# Altium schematic sheet CAN_Audio.SchDoc: CAN & Audio
size A4; Organization: Use Organization_Name in ProjParam; Address1: EFI & DBR; Address2: STI-IMT-LSRO1; Address3: EPFL; Address4: CH-1015 LAUSANNE; DocumentNumber: 4; Revision: A; SheetNumber: 4; SheetTotal: 2; ApprovedBy: Init ApprovedBy in DocParam; CheckedBy: Init CheckedBy in DocParam; Author: Init Author in DocParam; CompanyName: Init CompanyName in DocParam; DrawnBy: Init DrawBy in DocParam; Engineer: Init Engineer in DocParam; DocumentName: Init DocumentName in DocParam; ProjectName: Init ProjectName in DocParam
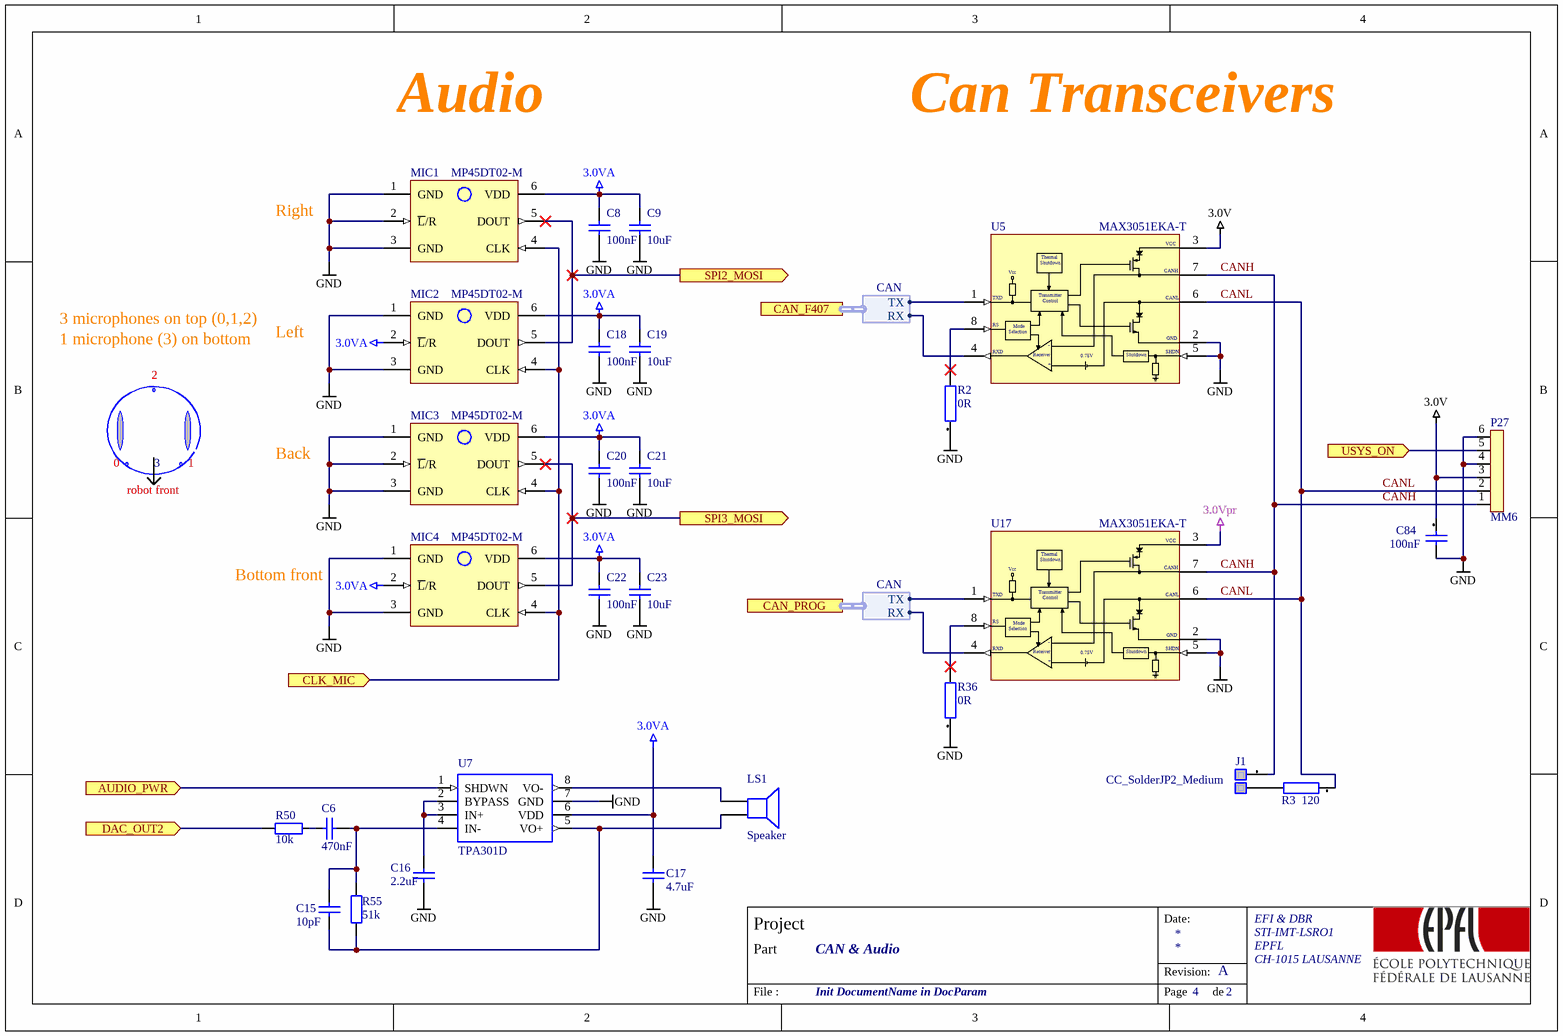
[diagram p0: CAN_Audio.SchDoc]

## Parts
C6  470nF  [ROB_0603]
C8  100nF  [ROB_0603]
C9  10uF  [ROB_0603]
C15  10pF  [ROB_0603]
C16  2.2uF  [ROB_0603]
C17  4.7uF  [rob_0603]
C18  100nF  [ROB_0603]
C19  10uF  [ROB_0603]
C20  100nF  [ROB_0603]
C21  10uF  [ROB_0603]
C22  100nF  [ROB_0603]
C23  10uF  [ROB_0603]
C84  100nF  [ROB_0603]
J1  CC_SolderJP2_Medium  [soldeJP_M]  (no BOM)
LS1  Speaker  [DS-1389]
MIC1  MP45DT02-M  [HLGA-6L]
MIC2  MP45DT02-M  [HLGA-6L]
MIC3  MP45DT02-M  [HLGA-6L]
MIC4  MP45DT02-M  [HLGA-6L]
P27  MM6  [TYCO_7-188275-6]
R2  0R  [ROB_0603]
R3  120  [ROB_0603]
R36  0R  [ROB_0603]
R50  10k  [ROB_0603]
R55  51k  [ROB_0603]
U5  MAX3051EKA-T  [SOT23-8]
U7  TPA301D  [SO-8]
U17  MAX3051EKA-T  [SOT23-8]

## Ports
AUDIO_PWR (in), CAN_F407 (harness CAN), CAN_PROG (harness CAN), CLK_MIC (in), DAC_OUT2 (in), SPI2_MOSI (out), SPI3_MOSI (out), USYS_ON (in)

## Harnesses
CAN: TX, RX

## Nets
3.0V: C84.1 P27.3 U5.3(VCC)
3.0VA: C8.2 C9.2 C17.2 C18.2 C19.2 C20.2 C21.2 C22.2 C23.2 MIC1.6(VDD) MIC2.2(~{L}/R) MIC2.6(VDD) MIC3.6(VDD) MIC4.2(~{L}/R) MIC4.6(VDD) U7.6(VDD)
3.0Vpr: U17.3(VCC)
GND: C8.1 C9.1 C16.2 C17.1 C18.1 C19.1 C20.1 C21.1 C22.1 C23.1 C84.2 MIC1.1(GND) MIC1.2(~{L}/R) MIC1.3(GND) MIC2.1(GND) MIC2.3(GND) MIC3.1(GND) MIC3.2(~{L}/R) MIC3.3(GND) MIC4.1(GND) MIC4.3(GND) P27.4 P27.6 R2.1 R36.1 U5.2(GND) U5.5(SHDN) U7.7(GND) U17.2(GND) U17.5(SHDN)
AUDIO_PWR: U7.1(SHDWN) ; port AUDIO_PWR
CANH: J1.1 P27.1 U5.7(CANH) U17.7(CANH)
CANL: P27.2 R3.1 U5.6(CANL) U17.6(CANL)
CLK_MIC: MIC1.4(CLK) MIC2.4(CLK) MIC3.4(CLK) MIC4.4(CLK) ; port CLK_MIC
DAC_OUT2: R50.1 ; port DAC_OUT2
SPI2_MOSI: MIC1.5(DOUT) MIC2.5(DOUT) ; port SPI2_MOSI
SPI3_MOSI: MIC3.5(DOUT) MIC4.5(DOUT) ; port SPI3_MOSI
USYS_ON: P27.5 ; port USYS_ON
NetC6_1: C6.1 C15.2 R55.1 U7.4(IN-)
NetC6_2: C6.2 R50.2
NetC15_1: C15.1 LS1.1 R55.2 U7.5(VO+)
NetC16_1: C16.1 U7.2(BYPASS) U7.3(IN+)
NetJ1_2: J1.2 R3.2
NetLS1_2: LS1.2 U7.8(VO-)
NetR2_2: R2.2 U5.8(RS)
NetR36_2: R36.2 U17.8(RS)
NetU5_1: U5.1(TXD) ; port CAN_F407.TX
NetU5_4: U5.4(RXD) ; port CAN_F407.RX
NetU17_1: U17.1(TXD) ; port CAN_PROG.TX
NetU17_4: U17.4(RXD) ; port CAN_PROG.RX

## Notes on the sheet
- Audio
- Can Transceivers
- Right
- 3 microphones on top (0,1,2)
- 1 microphone (3) on bottom
- 2
- Left
- 0
- robot front
- 3
- 1
- Back
- Bottom front
- Date:
- Project
- Part
- Revision:
- File :
- Page
- de
- (in symbol MAX3051EKA-T[[/\]]1) Thermal; Shutdown; Vcc; Transmitter; Control; Mode; Selection; -; Receiver; 0.75V; +

## Library data of the parts
C6 C8 C9 C15-C23 = Cap: Capacitor; Published: 8-Jun-2000; LatestRevisionDate: 17-Jul-2002; LatestRevisionNote: Re-released for DXP Platform.; PackageReference: RAD-0.3; Publisher: Altium Limited
  C6: Value: 470nF
  C8 C18 C20 C22: Value: 100nF
  C9 C19 C21 C23: Value: 10uF
  C15: Value: 10pF
  C16: Value: 2.2uF
  C17: Value: 4.7uF
C84 = 100nF[[/\]]0603[[/\]]1: Capacitor; Manufacturer: Kemet; Manufacturer Nr: C0603C104K5RAC; Preference: 1; Tolerance +: +10; Tolerance -: -10; Dielectric: X7R; Voltage: 50; MaxTemperature: +125; MinTemperature: -55; Quant_1: 10; Quant_2: 100; Quant_3: 1000; Quant_4: 4000; Currentie: CHF; Size: 0603; Footprint Acort: 0603_G; Supplier: Farnell; Supplier Nr: 1288255; ComponentLink2Description: Farnell link; ComponentLink2URL: http://ch.farnell.com/jsp/displayProduct.jsp?sku=1288255; Price_1: 0,046; Price_2: 0,04; Price_3: 0,037; Price_4: 0,036; ROHS: True; DateLastUpdate: 2007-12-03 / 14:22:31; Value: 100nF
J1 = CC_SolderJP2_Medium: Medium Solder Jumper 2 leads; Preference: 1; Footprint Acort: ToDefine; DateLastUpdate: 2007-11-06 / 20:24:14
LS1 = Speaker: Loudspeaker 12mm; value: mouser PSR12N08AK; Published: 24-Mar-1999; LatestRevisionDate: 17-Jul-2002; LatestRevisionNote: Re-released for DXP Platform.; PackageReference: PIN2; Publisher: Altium Limited
MIC1-MIC4 = MP45DT02-M: MEMS Omnidirectional Digital Microphone; Value: MP45DT02-M
P27 = MM6FVS[[/\]]1: Micro-Match 6 pins Female on board Vertical Smd connector; Manufacturer: Tyco; Manufacturer Nr: 7-188275-6; Preference: 1; Currentie: CHF; Quant_1: 10; Quant_2: 900; value: farnell 1056234; Footprint Acort: ToDefine; ComponentLink1Description: Datasheet; ComponentLink1URL: http://ecommas.tycoelectronics.com/commerce/DocumentDelivery/DDEController?Action=showdoc&DocId=Customer+Drawing%7F188275%7FR%7Fpdf%7FEnglish%7FC_188275_R.pdf; Supplier: Farnell; Supplier Nr: 1056234; ComponentLink2Description: Farnell link; ComponentLink2URL: http://fr.farnell.com/jsp/displayProduct.jsp?sku=1056234; ROHS: True; Type: SMD; Orientation: Vertical; DateLastUpdate: 2007-12-04 / 09:15:57; Price_1: 1,1; Price_2: 0,924
R2 R36 = 0R[[/\]]0603[[/\]]1: Resistor; Manufacturer: Vishay; Manufacturer Nr: D11CRCW06030B000Z; Tolerance: +/-1; Preference: 1; Power: 0.1; Voltage: 75; Current: 1.5; ppm/K: +/-200; Quant_1: 10; Quant_2: 100; Quant_3: 500; Currentie: CHF; Value: 0R; Size: 0603; Footprint Acort: 0603; Supplier: Distrelec; Supplier Nr: 715151; ComponentLink2Description: Distrelec link; ComponentLink2URL: http://www.distrelec.com/ishopWebFront/search/luceneSearch.do?dispatch=find&showImage=on&artnrPhrase=715151; ROHS: True; Price_1: 0,0592; Price_2: 0,0398; Price_3: 0,0247; DateLastUpdate: 2007-12-03 / 16:30:07
R3 = 120R[[/\]]0603[[/\]]2: Resistor; Manufacturer: Multicomp; Manufacturer Nr: MC 0.063W 0603 1% 120R; Tolerance: +/-1; Preference: 2; Power: 0.063; Voltage: 50; Current: 1; ppm/K: +/-100; Quant_2: 250; Quant_3: 1000; Quant_4: 5000; Quant_5: 15000; Currentie: CHF; Value: 120; Size: 0603; Footprint Acort: 0603; Supplier: Farnell; Supplier Nr: 9330496; ComponentLink2Description: Farnell link; ComponentLink2URL: http://ch.farnell.com/jsp/displayProduct.jsp?sku=9330496; ROHS: True; Quant_1: 50; Price_1: 0,062; Price_2: 0,049; Price_3: 0,038; Price_4: 0,027; Price_5: 0,021; DateLastUpdate: 2007-11-29 / 09:25:53
R50 R55 = Res2: Resistor; Published: 8-Jun-2000; LatestRevisionDate: 17-Jul-2002; LatestRevisionNote: Re-released for DXP Platform.; PackageReference: AXIAL-0.4; Publisher: Altium Limited
  R50: Value: 10k
  R55: Value: 51k
U5 U17 = MAX3051EKA-T[[/\]]1: +3.3V, 1Mbps, Low-Supply-Current CAN Transceiver; Manufacturer: Maxim; Preference: 1; Currentie: CHF; Size: SOT23-8; Footprint Acort: ToDefine; Manufacturer Nr: MAX3051EKA-T; ROHS: True; DateLastUpdate: 2012-06-17 / 01:26:47
U7 = TPA301D: Value: *